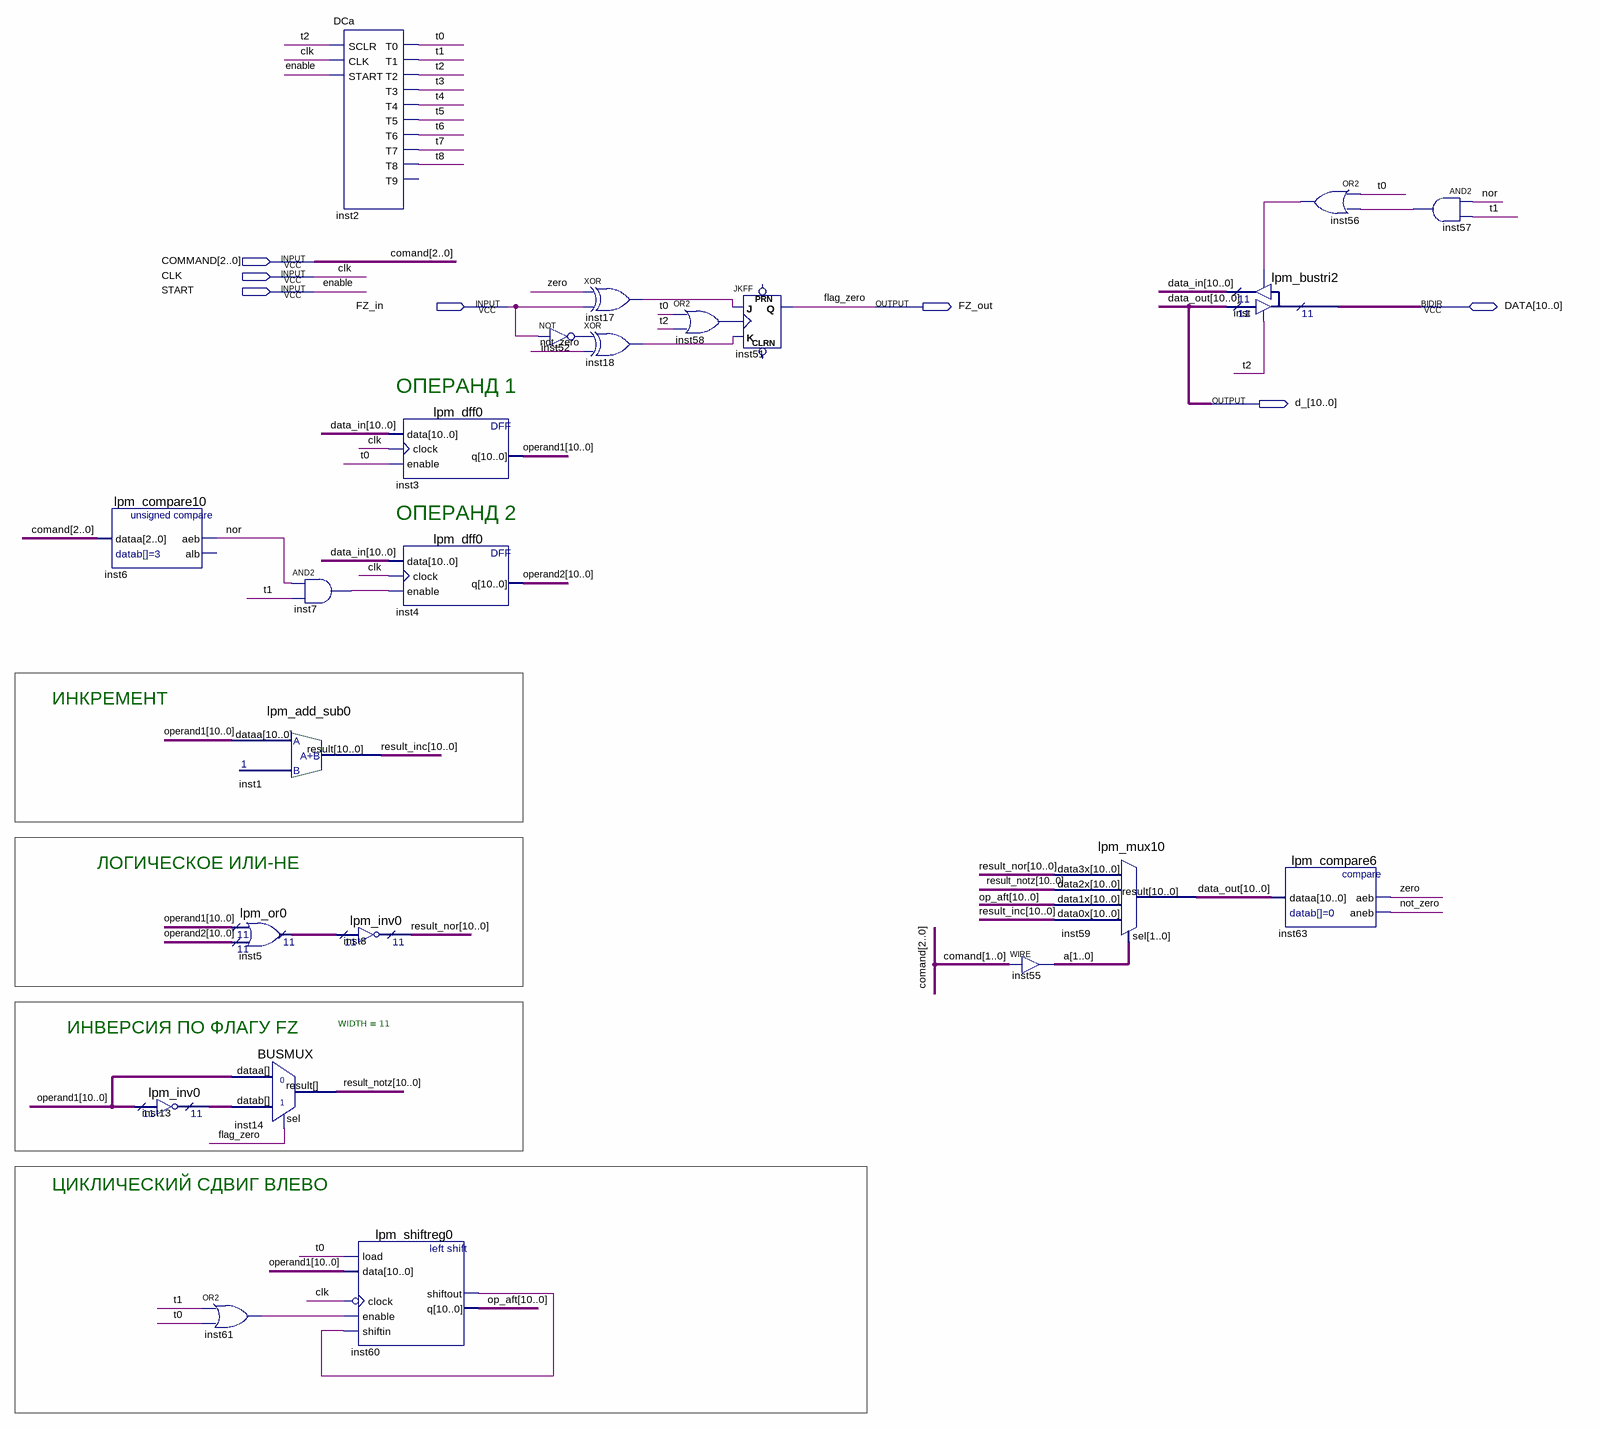
[diagram p0: schematic sheet]
// Quartus schematic ALU.bdf as structural Verilog: 23 symbols, 7 pins
module ALU (
  input  [2:0] COMMAND,
  input  CLK,
  input  START,
  input  FZ_in,
  inout  [10:0] DATA,
  output FZ_out,
  output [10:0] d_
);

  wire inst7_out, inst17_out, inst18_out, inst52_out, inst56_out, inst57_out, inst58_out, inst60_shiftout,
       inst61_out, \nor , not_zero, t0, t1, t2, t3, t4, t5, t6, t7, t8, zero;
  wire [1:0] a;
  wire [10:0] data_in, inst5_result, inst13_result, op_aft, operand1, operand2, result_inc, result_nor,
       result_notz;

  lpm_compare10 inst6 (.dataa(COMMAND), .aeb(\nor ));  // open: alb
  lpm_inv0 inst13 (.data(operand1), .result(inst13_result));
  lpm_add_sub0 inst1 (.dataa(operand1), .result(result_inc));
  lpm_or0 inst5 (.data0x(operand1), .data1x(operand2), .result(inst5_result));
  BUSMUX #(.WIDTH(11)) inst14 (.datab(inst13_result), .sel(FZ_out), .dataa(operand1), .result(result_notz));
  or inst61 (inst61_out, t1, t0);
  and inst7 (inst7_out, \nor , t1);
  DCa inst2 (
    .SCLR(t2), .CLK(CLK), .START(START), .T0(t0), .T1(t1), .T2(t2), .T3(t3), .T4(t4), .T5(t5), .T6(t6),
    .T7(t7), .T8(t8));  // open: T9
  lpm_inv0 inst8 (.data(inst5_result), .result(result_nor));
  lpm_shiftreg0 inst60 (
    .load(t0), .data(operand1), .clock(~CLK), .enable(inst61_out), .shiftin(inst60_shiftout),
    .shiftout(inst60_shiftout), .q(op_aft));
  lpm_dff0 inst3 (.data(data_in), .clock(CLK), .enable(t0), .q(operand1));
  lpm_dff0 inst4 (.data(data_in), .clock(CLK), .enable(inst7_out), .q(operand2));
  not inst52 (inst52_out, FZ_in);
  xor inst17 (inst17_out, zero, FZ_in);
  xor inst18 (inst18_out, inst52_out, not_zero);
  or inst58 (inst58_out, t0, t2);
  JKFF inst51 (.K(inst18_out), .J(inst17_out), .CLK(inst58_out), .Q(FZ_out));  // open: PRN, CLRN
  assign a = COMMAND[1:0];  // WIRE inst55
  lpm_mux10 inst59 (
    .data3x(result_nor), .data2x(result_notz), .data1x(op_aft), .data0x(result_inc), .sel(a), .result(d_));
  lpm_bustri2 inst (.enabledt(t2), .data(d_), .enabletr(inst56_out), .result(data_in), .tridata(DATA));
  lpm_compare6 inst63 (.dataa(d_), .aeb(zero), .aneb(not_zero));
  or inst56 (inst56_out, t0, inst57_out);
  and inst57 (inst57_out, \nor , t1);

  // Other names for the same wires on the sheet: comand[2:0] = COMMAND; data_out[10:0] = d_; enable = START;
  //   flag_zero = FZ_out

  // Notes on the sheet:
  //   ОПЕРАНД 1
  //   ОПЕРАНД 2
  //   ИНКРЕМЕНТ
  //   ЛОГИЧЕСКОЕ ИЛИ-НЕ
  //   ИНВЕРСИЯ ПО ФЛАГУ FZ
  //   ЦИКЛИЧЕСКИЙ СДВИГ ВЛЕВО
endmodule
